# Altium schematic sheet micro-sd-card-reader.SchDoc
size 297 x 209 mm
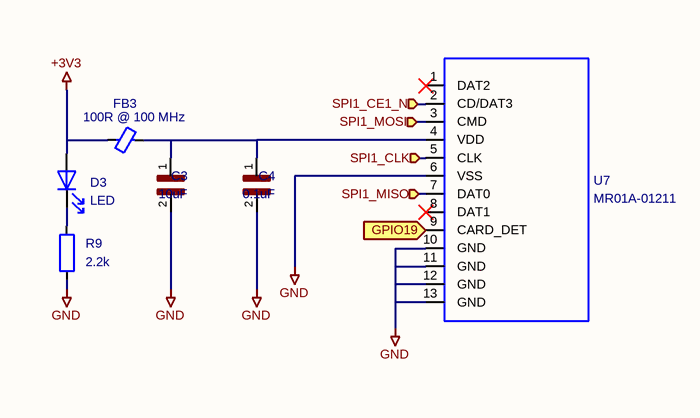
[diagram p0: micro-sd-card-reader.SchDoc]

## Parts
C3  10uF  [C_0603_1608Metric]
C4  0.1uF  [C_0603_1608Metric]
D3  LED  [LED_0603_1608Metric]
FB3  100R @ 100 MHz  [L_0603_1608Metric]
R9  2.2k  [R_0603_1608Metric]
U7  MR01A-01211  [MR01A-01211]

## Ports
GPIO19 (in), SPI1_CE1_N (in), SPI1_CLK (in), SPI1_MISO (in), SPI1_MOSI (in)

## Nets
+3V3: D3.2(A) FB3.1
GND: C3.2 C4.2 R9.2 U7.6(VSS) U7.10(GND) U7.11(GND) U7.12(GND) U7.13(GND)
GPIO19: U7.9(CARD_DET) ; port GPIO19
SPI1_CE1_N: U7.2(CD/DAT3) ; port SPI1_CE1_N
SPI1_CLK: U7.5(CLK) ; port SPI1_CLK
SPI1_MISO: U7.7(DAT0) ; port SPI1_MISO
SPI1_MOSI: U7.3(CMD) ; port SPI1_MOSI
NetC3_1: C3.1 C4.1 FB3.2 U7.4(VDD)
NetD3_1: D3.1(K) R9.1

Not connected (* = marked no-connect by the designer): U7 1(DAT2)* 8(DAT1)*

## Notes on the sheet
- 1
- 2
- 3
- 4
- 5
- 6
- A
- B
- C
- D
- Title:
- File: micro-sd-card-reader.kicad_sch
- Sheet: /
- KiCad E.D.A.  kicad (5.1.4)-1
- Size: A4
- Date:
- Rev:
- Id: 1/1

## Library data of the parts
C3 C4 = CL10B104KB8NNNL: Footprint: Capacitor_SMD:C_0603_1608Metric
  C3: Value: 10uF
  C4: Value: 0.1uF
FB3 = FerriteBead_Small: Value: 100R @ 100 MHz; Footprint: Inductor_SMD:L_0603_1608Metric
R9 = R: Value: 2.2k; Footprint: Resistor_SMD:R_0603_1608Metric
D3 = LED: Value: LED; Footprint: LED_SMD:LED_0603_1608Metric
U7 = MR01A-01211: Value: MR01A-01211; Footprint: qset-footprints:MR01A-01211